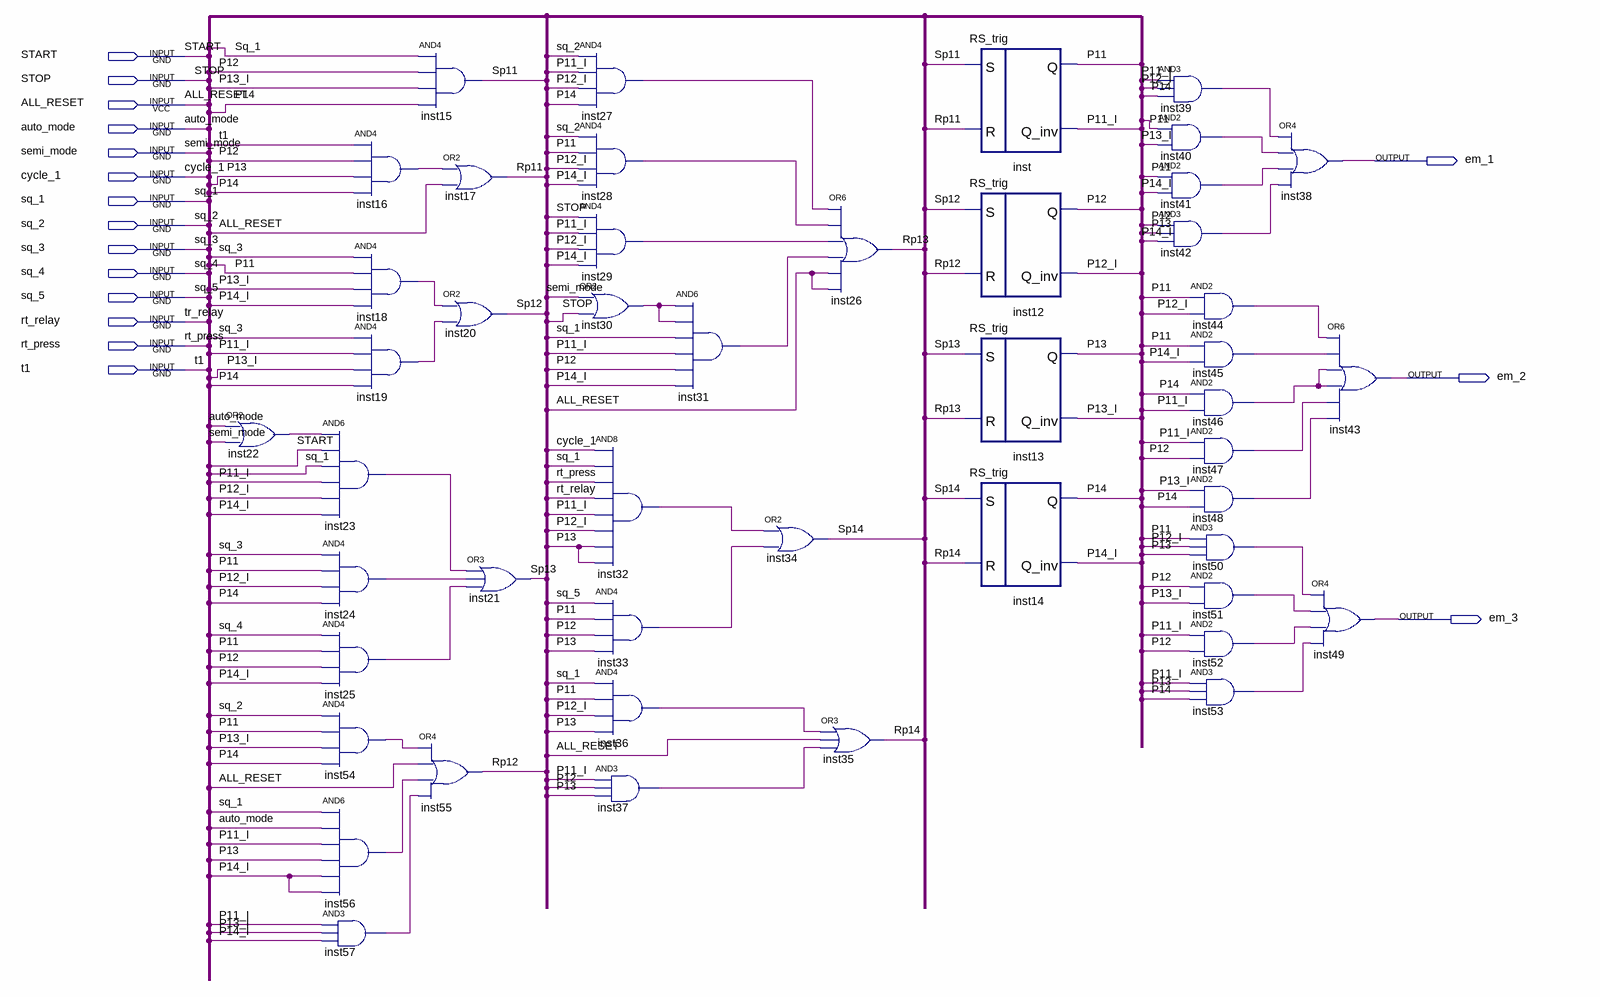
[diagram p0: schematic sheet]
// Quartus schematic cycle_1.bdf as structural Verilog: 47 symbols, 17 pins
module cycle_1 (
  input  START,
  input  STOP,
  input  ALL_RESET,
  input  auto_mode,
  input  semi_mode,
  input  cycle_1,
  input  sq_1,
  input  sq_2,
  input  sq_3,
  input  sq_4,
  input  sq_5,
  input  rt_relay,
  input  rt_press,
  input  t1,
  output em_1,
  output em_2,
  output em_3
);

  wire inst16_out, inst18_out, inst19_out, inst22_out, inst23_out, inst24_out, inst25_out, inst27_out,
       inst28_out, inst29_out, inst30_out, inst31_out, inst32_out, inst33_out, inst36_out, inst37_out,
       inst39_out, inst40_out, inst41_out, inst42_out, inst44_out, inst45_out, inst46_out, inst47_out,
       inst48_out, inst50_out, inst51_out, inst52_out, inst53_out, inst54_out, inst56_out, inst57_out, P11,
       P11_I, P12, P12_I, P13, P13_I, P14, P14_I, Rp11, Rp12, Rp13, Rp14, Sp11, Sp12, Sp13, Sp14;

  or inst22 (inst22_out, auto_mode, semi_mode);
  and inst16 (inst16_out, t1, P12, P13, P14);
  and inst18 (inst18_out, sq_3, P11, P13_I, P14_I);
  and inst19 (inst19_out, sq_3, P11_I, P13_I, P14);
  and inst23 (inst23_out, inst22_out, START, sq_1, P11_I, P12_I, P14_I);
  and inst24 (inst24_out, sq_3, P11, P12_I, P14);
  and inst25 (inst25_out, sq_4, P11, P12, P14_I);
  and inst54 (inst54_out, sq_2, P11, P13_I, P14);
  and inst56 (inst56_out, sq_1, auto_mode, P11_I, P13, P14_I, P14_I);
  and inst57 (inst57_out, P11_I, P13_I, P14_I);
  and inst15 (Sp11, sq_1, P12, P13_I, P14);
  or inst17 (Rp11, inst16_out, ALL_RESET);
  or inst20 (Sp12, inst18_out, inst19_out);
  or inst55 (Rp12, inst54_out, ALL_RESET, inst56_out, inst57_out);
  or inst21 (Sp13, inst23_out, inst24_out, inst25_out);
  and inst27 (inst27_out, sq_2, P11_I, P12_I, P14);
  and inst28 (inst28_out, sq_2, P11, P12_I, P14_I);
  and inst29 (inst29_out, STOP, P11_I, P12_I, P14_I);
  or inst30 (inst30_out, semi_mode, STOP);
  and inst32 (inst32_out, cycle_1, sq_1, rt_press, rt_relay, P11_I, P12_I, P13, P13);
  and inst33 (inst33_out, sq_5, P11, P12, P13);
  and inst36 (inst36_out, sq_1, P11, P12_I, P13);
  and inst37 (inst37_out, P11_I, P12, P13);
  and inst31 (inst31_out, inst30_out, inst30_out, sq_1, P11_I, P12, P14_I);
  or inst34 (Sp14, inst32_out, inst33_out);
  or inst26 (Rp13, inst27_out, inst28_out, inst29_out, inst31_out, ALL_RESET, ALL_RESET);
  or inst35 (Rp14, inst36_out, ALL_RESET, inst37_out);
  RS_trig inst (.S(Sp11), .R(Rp11), .Q(P11), .Q_inv(P11_I));
  RS_trig inst12 (.S(Sp12), .R(Rp12), .Q(P12), .Q_inv(P12_I));
  RS_trig inst13 (.S(Sp13), .R(Rp13), .Q(P13), .Q_inv(P13_I));
  RS_trig inst14 (.S(Sp14), .R(Rp14), .Q(P14), .Q_inv(P14_I));
  and inst39 (inst39_out, P11_I, P12_I, P14);
  and inst40 (inst40_out, P11, P13_I);
  and inst41 (inst41_out, P11, P14_I);
  and inst42 (inst42_out, P12, P13, P14_I);
  and inst44 (inst44_out, P11, P12_I);
  and inst45 (inst45_out, P11, P14_I);
  and inst46 (inst46_out, P14, P11_I);
  and inst47 (inst47_out, P11_I, P12);
  and inst48 (inst48_out, P13_I, P14);
  and inst50 (inst50_out, P11, P12_I, P13);
  and inst51 (inst51_out, P12, P13_I);
  and inst52 (inst52_out, P11_I, P12);
  and inst53 (inst53_out, P11_I, P13, P14);
  or inst38 (em_1, inst39_out, inst40_out, inst41_out, inst42_out);
  or inst43 (em_2, inst44_out, inst45_out, inst46_out, inst46_out, inst47_out, inst48_out);
  or inst49 (em_3, inst50_out, inst51_out, inst52_out, inst53_out);

  // Other names for the same wires on the sheet: tr_relay = rt_relay
endmodule
